# Altium schematic sheet Stellaris_LM3S5Y36.SchDoc
size A3
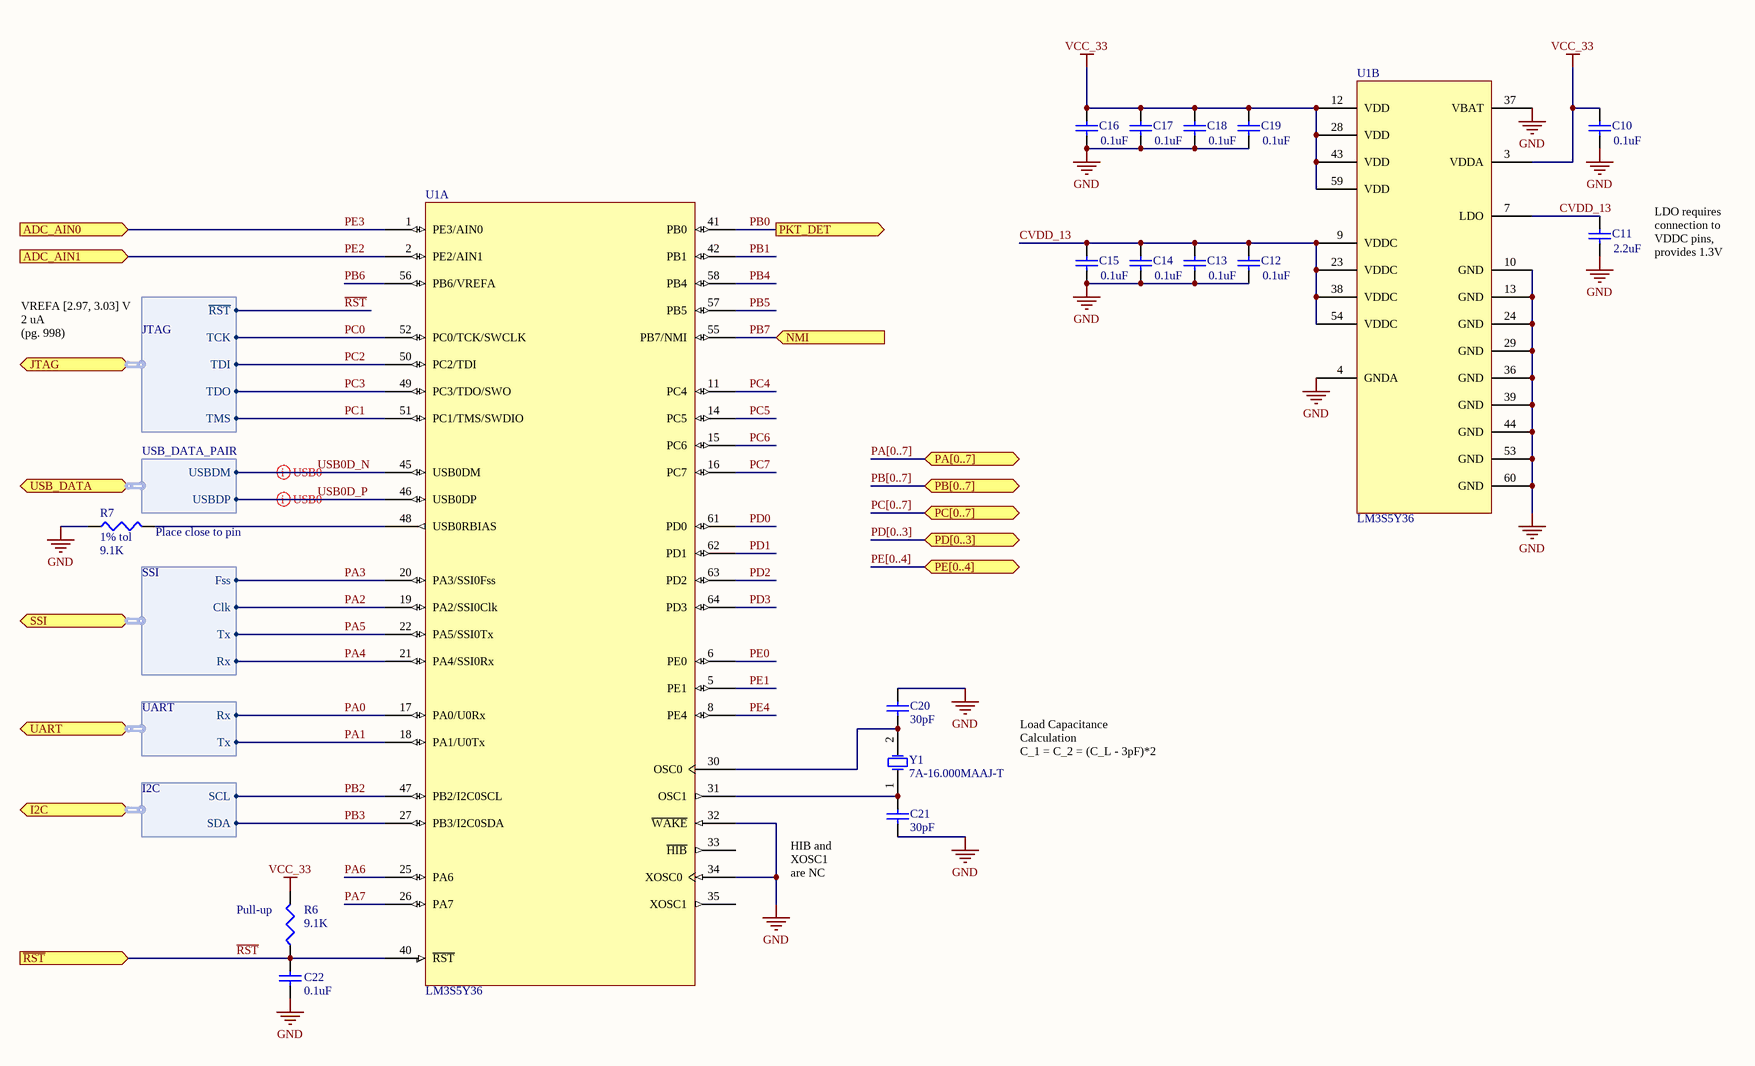
[diagram p0: Stellaris_LM3S5Y36.SchDoc]

## Parts
C10  value 0.1uF  [1608[0603]]  (hidden comment: Cap)
C11  value 2.2uF  [1608[0603]]  (hidden comment: Cap)
C12  value 0.1uF  [1608[0603]]  (hidden comment: Cap)
C13  value 0.1uF  [1608[0603]]  (hidden comment: Cap)
C14  value 0.1uF  [1608[0603]]  (hidden comment: Cap)
C15  value 0.1uF  [1608[0603]]  (hidden comment: Cap)
C16  value 0.1uF  [1608[0603]]  (hidden comment: Cap)
C17  value 0.1uF  [1608[0603]]  (hidden comment: Cap)
C18  value 0.1uF  [1608[0603]]  (hidden comment: Cap)
C19  value 0.1uF  [1608[0603]]  (hidden comment: Cap)
C20  value 30pF  [1608[0603]]  (hidden comment: Cap Semi)
C21  value 30pF  [1608[0603]]  (hidden comment: Cap Semi)
C22  value 0.1uF  [1608[0603]]  (hidden comment: Cap Semi)
R6  value 9.1K  [J1-0603]  (hidden comment: 1% tol)
R7  1% tol  value 9.1K  [J1-0603]
U1  LM3S5Y36  [PQFP-64-TI_Stellaris]  (parts A,B of 2)
Y1  7A-16.000MAAJ-T  [XTAL_SMT_5_3-2]

## Ports
ADC_AIN0 (in), ADC_AIN1 (in), I2C (harness I2C), JTAG (harness JTAG), NMI (in), PA[0..7], PB[0..7], PC[0..7], PD[0..3], PE[0..4], PKT_DET (out), SSI (harness SSI), UART (harness UART), USB_DATA (harness USB_DATA_PAIR), ~{RST} (in)

## Harnesses
JTAG: TCK, TDI, TDO, TMS, ~{RST}
SSI: Fss, Clk, Tx, Rx
UART: Rx, Tx
I2C: SCL, SDA
USB_DATA_PAIR: USBDM, USBDP

## Nets
GND: C10.1 C11.1 C12.1 C13.1 C14.1 C15.1 C16.1 C17.1 C18.1 C19.1 C20.2 C21.1 C22.1 R7.1 U1.4(GNDA) U1.10(GND) U1.13(GND) U1.24(GND) U1.29(GND) U1.32(~{WAKE}) U1.34(XOSC0) U1.36(GND) U1.37(VBAT) U1.39(GND) U1.44(GND) U1.53(GND) U1.60(GND)
VCC_33: C10.2 C16.2 C17.2 C18.2 C19.2 R6.2 U1.3(VDDA) U1.12(VDD) U1.28(VDD) U1.43(VDD) U1.59(VDD)
~{RST}: C22.2 R6.1 U1.40(~{RST}) ; port ~{RST}, port JTAG.~{RST}
CVDD_13: C11.2 C12.2 C13.2 C14.2 C15.2 U1.7(LDO) U1.9(VDDC) U1.23(VDDC) U1.38(VDDC) U1.54(VDDC)
PA0: U1.17(PA0/U0Rx) ; port UART.Rx
PA1: U1.18(PA1/U0Tx) ; port UART.Tx
PA2: U1.19(PA2/SSI0Clk) ; port SSI.Clk
PA3: U1.20(PA3/SSI0Fss) ; port SSI.Fss
PA4: U1.21(PA4/SSI0Rx) ; port SSI.Rx
PA5: U1.22(PA5/SSI0Tx) ; port SSI.Tx
PA6: U1.25(PA6)
PA7: U1.26(PA7)
PB0: U1.41(PB0) ; port PKT_DET
PB1: U1.42(PB1)
PB2: U1.47(PB2/I2C0SCL) ; port I2C.SCL
PB3: U1.27(PB3/I2C0SDA) ; port I2C.SDA
PB4: U1.58(PB4)
PB5: U1.57(PB5)
PB6: U1.56(PB6/VREFA)
PB7: U1.55(PB7/NMI) ; port NMI
PC0: U1.52(PC0/TCK/SWCLK) ; port JTAG.TCK
PC1: U1.51(PC1/TMS/SWDIO) ; port JTAG.TMS
PC2: U1.50(PC2/TDI) ; port JTAG.TDI
PC3: U1.49(PC3/TDO/SWO) ; port JTAG.TDO
PC4: U1.11(PC4)
PC5: U1.14(PC5)
PC6: U1.15(PC6)
PC7: U1.16(PC7)
PD0: U1.61(PD0)
PD1: U1.62(PD1)
PD2: U1.63(PD2)
PD3: U1.64(PD3)
PE0: U1.6(PE0)
PE1: U1.5(PE1)
PE2: U1.2(PE2/AIN1) ; port ADC_AIN1
PE3: U1.1(PE3/AIN0) ; port ADC_AIN0
PE4: U1.8(PE4)
USB0D_N: U1.45(USB0DM) ; port USB_DATA.USBDM
USB0D_P: U1.46(USB0DP) ; port USB_DATA.USBDP
NetC20_1: C20.1 U1.30(OSC0) Y1.2(OSC2)
NetC21_2: C21.2 U1.31(OSC1) Y1.1(OSC1)
NetR7_2: R7.2 U1.48(USB0RBIAS)

Not connected (* = marked no-connect by the designer): U1 33(~{HIB}) 35(XOSC1)

## Buses and harness runs
bus PA[0..7] = port PA[0..7]
bus PB[0..7] = port PB[0..7]
bus PC[0..7] = port PC[0..7]
bus PD[0..3] = port PD[0..3]
bus PE[0..4] = port PE[0..4]

## Layout directives
differential pair: USB0D_N, USB0D_P

## Notes on the sheet
- LDO requires connection to VDDC pins, provides 1.3V
- VREFA [2.97, 3.03] V
  2 uA
  (pg. 998)
- (near R7) Place close to pin
- Load Capacitance Calculation
  C_1 = C_2 = (C_L - 3pF)*2
  (TI spma036 pg. 6)
- (near R6) Pull-up
- HIB and XOSC1 are NC

## Library data of the parts
C10-C22 = Cap Semi: Capacitor (Semiconductor SIM Model); Published: 8-Jun-2000; LatestRevisionDate: 29-May-2009; LatestRevisionNote: IPC-7351 Footprint Added.; PackageReference: C1206; Publisher: Altium Limited; PackageDescription: Chip Capacitor
R6 R7 = Res3: Resistor; Published: 8-Jun-2000; LatestRevisionDate: 29-May-2009; LatestRevisionNote: IPC-7351 Footprint Added.; PackageReference: J1-0603; Publisher: Altium Limited; PackageDescription: Chip Resistor
U1 = LM3S5Y36: TI Stellaris LM3S5Y36 Microcontroller
Y1 = XTAL: Crystal Oscillator; Published: 8-Jun-2000; LatestRevisionDate: 17-Jul-2002; LatestRevisionNote: Re-released for DXP Platform.; PackageReference: R38; Publisher: Altium Limited; PackageDescription: Crystal, Thru-Hole; 2 Leads; Body 3.1 x 8.2 mm (Dia.xH)